# Altium schematic sheet rs232.SchDoc
size A4
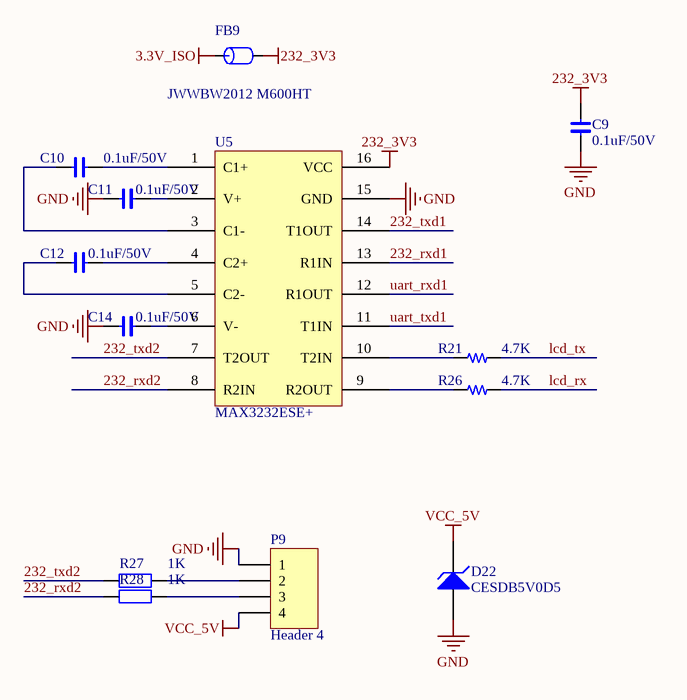
[diagram p0: rs232.SchDoc]

## Parts
C9  value 0.1uF/50V  [0603C]  (hidden comment: 0.1uF)  (no BOM)
C10  value 0.1uF/50V  [0603C]  (hidden comment: 0.1uF)  (no BOM)
C11  value 0.1uF/50V  [0603C]  (hidden comment: 0.1uF)  (no BOM)
C12  value 0.1uF/50V  [0603C]  (hidden comment: 0.1uF)  (no BOM)
C14  value 0.1uF/50V  [0603C]  (hidden comment: 0.1uF)  (no BOM)
D22  CESDB5V0D5  [sod323]  (no BOM)
FB9  JWWBW2012 M600HT  [0805R]  (no BOM)
P9  Header 4  [2ETYR-5.08-04P-14-100]
R21  4.7K  [0603R]  (no BOM)
R26  4.7K  [0603R]  (no BOM)
R27  1K  [0603R]  (no BOM)
R28  1K  [0603R]  (no BOM)
U5  MAX3232ESE+  [SOIC127P600X265-16N]  (no BOM)

## Nets
3.3V_ISO: FB9.1
232_3V3: C9.1 FB9.2 U5.16(VCC)
GND: C9.2 C11.2 C14.2 D22.1(A) P9.1 U5.15(GND)
VCC_5V: D22.2(K) P9.4
232_rxd1: U5.13(R1IN)
232_rxd2: R28.1 U5.8(R2IN)
232_txd1: U5.14(T1OUT)
232_txd2: R27.1 U5.7(T2OUT)
lcd_rx: R26.2
lcd_tx: R21.2
uart_rxd1: U5.12(R1OUT)
uart_txd1: U5.11(T1IN)
NetC10_1: C10.1 U5.1(C1+)
NetC10_2: C10.2 U5.3(C1-)
NetC11_1: C11.1 U5.2(V+)
NetC12_1: C12.1 U5.4(C2+)
NetC12_2: C12.2 U5.5(C2-)
NetC14_1: C14.1 U5.6(V-)
NetP9_2: P9.2 R27.2
NetP9_3: P9.3 R28.2
NetR21_1: R21.1 U5.10(T2IN)
NetR26_1: R26.1 U5.9(R2OUT)

## Library data of the parts
C9-C12 C14 = C
D22 = D Zener: Zener Diode; Published: 8-Jun-2000; LatestRevisionDate: 17-Jul-2002; LatestRevisionNote: Re-released for DXP Platform.; PackageReference: DIODE-0.7; Publisher: Altium Limited
FB9 = FB: Part Field 1: 磁珠/0603/1K ohm/100MHz; FB: BLM18BD102SN1(muRata); Text Field1: FB
P9 = Header 4: Header, 4-Pin; LatestRevisionDate: 17-Jul-2002; LatestRevisionNote: Re-released for DXP Platform.; Publisher: Altium Limited
R21 R26 = R: Value: 100
R27 R28 = Res0805M
U5 = MAX3232ESE+: Value: MAX3232ESE+